# EAGLE design Schematic (EAGLE 8.4.0)
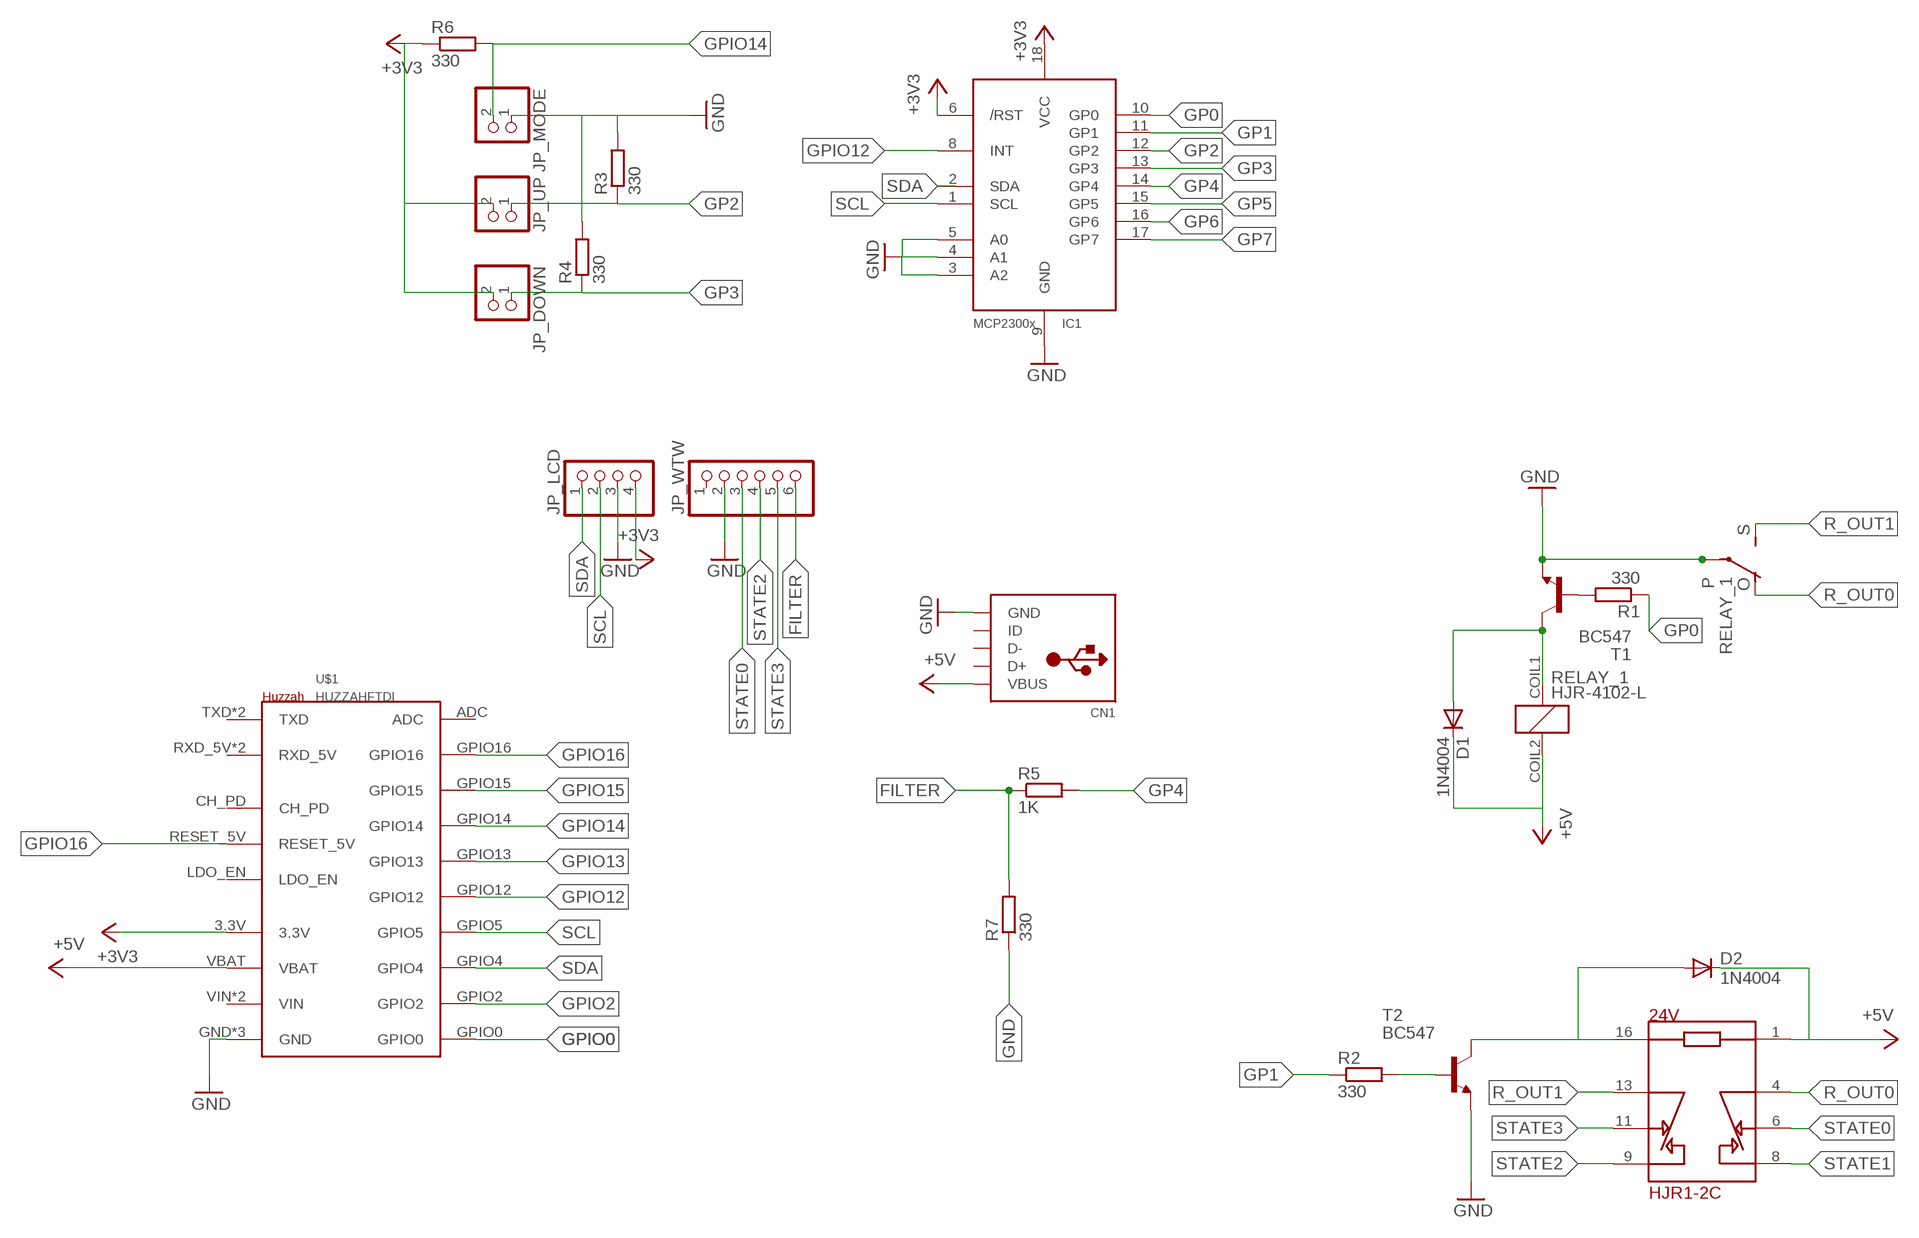
[diagram p0: schematic, sheet 1]

## Parts
CN1  USBTHM  [USB-MINIB-THM]
D1  1N4004  [DO41-10]
D2  1N4004  [DO41-10]
IC1  MCP23008/P  [DIL18]
JP_DOWN  PINHD-1X2  [1X02]
JP_LCD  PINHD-1X4  [1X04]
JP_MODE  PINHD-1X2  [1X02]
JP_UP  PINHD-1X2  [1X02]
JP_WTW  PINHD-1X6  [1X06]
R1  330  R-EU_0207/10  [0207/10]
R2  330  R-EU_0207/10  [0207/10]
R3  330  R-EU_0207/10  [0207/10]
R4  330  R-EU_0207/10  [0207/10]
R5  1K  R-EU_0207/10  [0207/10]
R6  330  R-EU_0207/10  [0207/10]
R7  330  R-EU_0207/10  [0207/10]
RELAY_1  HJR-4102-L  [HJR4102]
RELAY_2  HJR1-2C  [HJR1-2C]
T1  BC547  [TO92]
T2  BC547  [TO92]
U$1  HUZZAHFTDI  [HUZZAH-FULL]

## Nets
+3V3: IC1.6(/RST) IC1.18(VCC) JP_DOWN.2 JP_LCD.4 JP_UP.2 R6.1 U$1.3.3V
+5V: CN1.VBUS D1.C D2.C RELAY_1.COIL2 RELAY_2.1 U$1.VBAT
FILTER: JP_WTW.6 R5.1 R7.2
GND: CN1.GND IC1.3(A2) IC1.4(A1) IC1.5(A0) IC1.9(GND) JP_LCD.3 JP_MODE.1 JP_WTW.2 R3.2 R4.2 R7.1 RELAY_1.CENTER1(P) RELAY_1.CENTER2(P2) T1.1(E) T2.1(E) U$1.GND U$1.GND2(GND) U$1.GND3(GND)
GP0: IC1.10(GP0) R1.1
GP1: IC1.11(GP1) R2.1
GP2: IC1.12(GP2) JP_UP.1 R3.1
GP3: IC1.13(GP3) JP_DOWN.1 R4.1
GP4: IC1.14(GP4) R5.2
GP5: IC1.15(GP5)
GP6: IC1.16(GP6)
GP7: IC1.17(GP7)
GPIO0: U$1.GPIO0
GPIO2: U$1.GPIO2
GPIO12: IC1.8(INT) U$1.GPIO12
GPIO13: U$1.GPIO13
GPIO14: JP_MODE.2 R6.2 U$1.GPIO14
GPIO15: U$1.GPIO15
GPIO16: U$1.GPIO16 U$1.RESET_5V
N$1: R1.2 T1.2(B)
N$3: R2.2 T2.2(B)
R_OUT0: RELAY_1.CON2OPTION(O) RELAY_2.4
R_OUT1: RELAY_1.CON1DEFAULT(S) RELAY_2.13
SCL: IC1.1(SCL) JP_LCD.2 U$1.GPIO5
SDA: IC1.2(SDA) JP_LCD.1 U$1.GPIO4
STATE0: JP_WTW.3 RELAY_2.6
STATE1: RELAY_2.8
STATE2: JP_WTW.4 RELAY_2.9
STATE3: JP_WTW.5 RELAY_2.11
T1_RELAY1: D1.A RELAY_1.COIL1 T1.3(C)
T2_RELAY2: D2.A RELAY_2.16 T2.3(C)
Unconnected: CN1.D+ CN1.D- CN1.ID JP_WTW.1 U$1.ADC U$1.CH_PD U$1.LDO_EN U$1.RXD_5V U$1.RXD_5V-2(RXD_5V) U$1.TXD U$1.TXD2(TXD) U$1.VIN U$1.VIN2(VIN)

## Library data of the parts
CN1 = adafruit:USB: USB Connectors USBMINIB - Surface Mount Female Mini-B USB Connector 4UConnector: 06564 By microbuilder.eu Thru-hole RA Female Mini-B USB Connector 4UConnector: 18732 By ladyada.net
D1 D2 = diode:1N4004: DIODE general purpose rectifier, 1 A
IC1 = adafruit:MCP23008: MCP23008 Inexpensive i2c i/o expander - 8 general purpose i/o pins with optional pullups
JP_DOWN JP_MODE JP_UP = pinhead:PINHD-1X2: PIN HEADER
JP_LCD = pinhead:PINHD-1X4: PIN HEADER
JP_WTW = pinhead:PINHD-1X6: PIN HEADER
R1-R7 = resistor:R-EU_: RESISTOR, European symbol
RELAY_1 = relay:HJR-4102-L
RELAY_2 = hjr1-2c:HJR1-2C: TIANBO Relay 24VCD DPDT Configuration
T1 T2 = transistor:BC547: NPN TRANSISTOR
U$1 = tobias:HUZZAH: Adafruit Huzzah ESP8266 Footprint Fotprint to use the Huzzah. NOT TESTED Info: https://learn.adafruit.com/adafruit-huzzah-esp8266-breakout/overview Based on https://github.com/adafruit/Adafruit-Huzzah-ESP8266-Basic-Breakout-PCB

## Net classes
0 default: clearance 0.205 mm

## Board
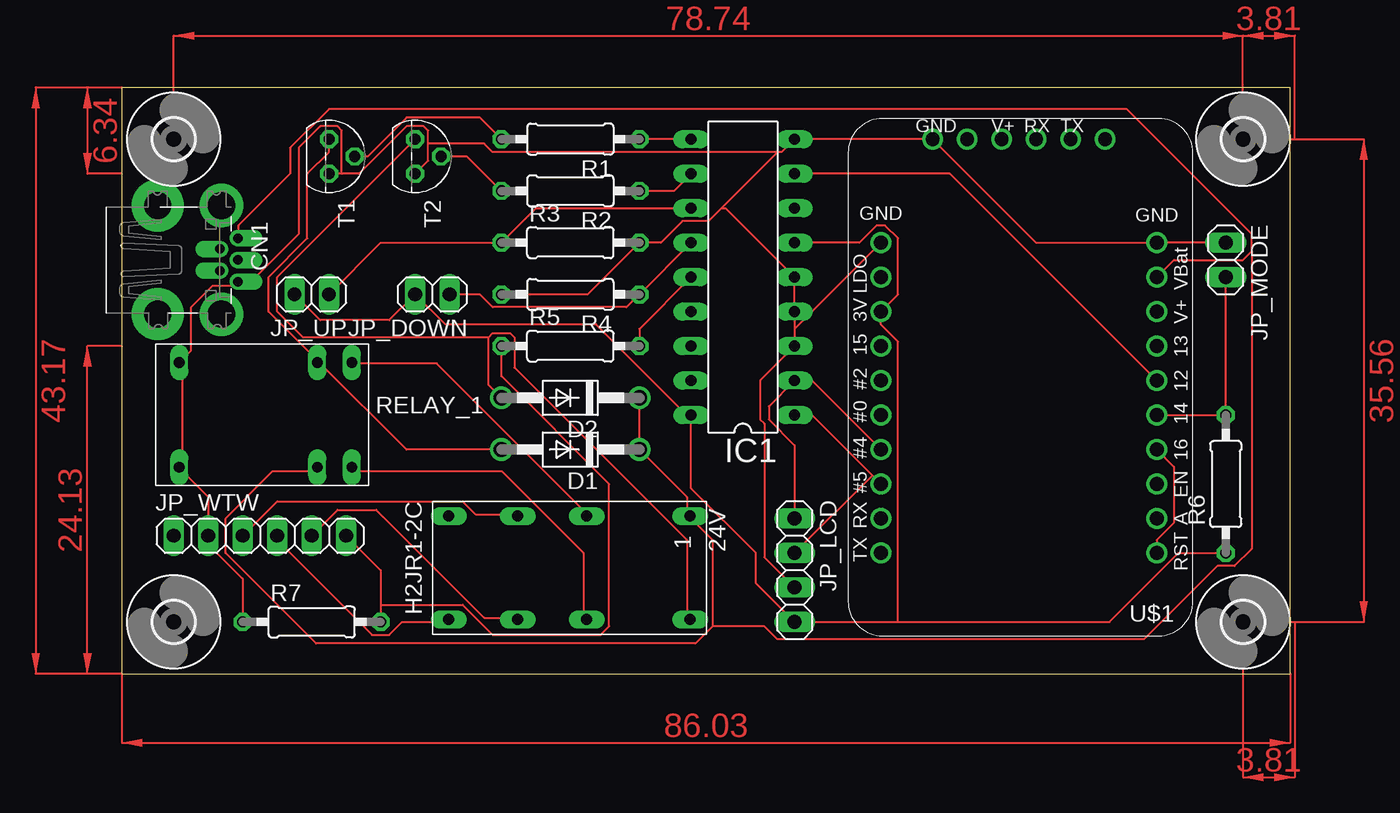
[diagram p1: board, top side]
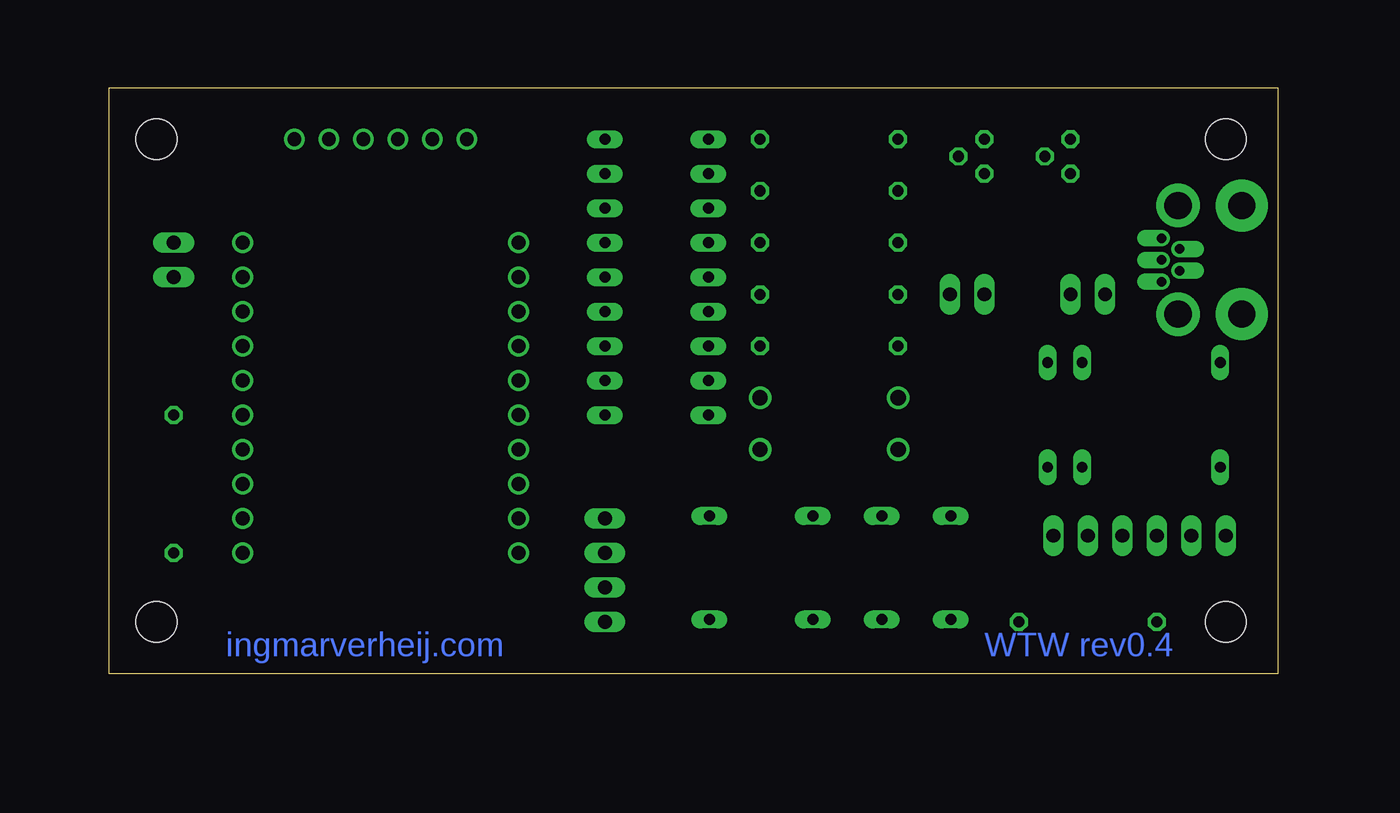
[diagram p2: board, bottom side, seen from below]

Size 86.03 x 43.17 mm. Coordinates in mm from the lower left corner, seen from the top.
Outline: 0,0 86.03,0 86.03,43.17 0,43.17 0,0
Copper layers (1*16): Top 0.035mm / dielectric 1.5mm / Bottom 0.035mm
Design rules "default": minimum track width 6mil, minimum drill 0.35mm, track to track 6mil, track to pad 6mil, pad to pad 6mil, via to via 6mil, smd to smd 6mil, copper to edge 40mil, drill to drill 6mil, minimum pad ring 10mil, minimum via ring 8mil, stop-mask expansion 4mil, vias tented up to drill 0mil, thermal gap 10mil

### Footprints (pad centres in the part's own frame; a part is rotated, then mirrored left to right if it is on the bottom)
USB-MINIB-THM = drill 0.7 offset: D+ 0,9.8; D- -0.8,8.5; GND 1.6,9.8; ID 0.8,8.5; VBUS -1.6,9.8 | drill 2 pad 3.81: GND1 -4,3.9; GND4 4,3.9 | drill 2 pad 3.2: GND2 -4,8.6; GND3 4,8.6
DO41-10 = drill 1.118: A 5.08,0; C -5.08,0
DIL18 = drill 0.813 long: 1 -10.16,-3.81; 2 -7.62,-3.81; 3 -5.08,-3.81; 4 -2.54,-3.81; 5 0,-3.81; 6 2.54,-3.81; 7 5.08,-3.81; 8 7.62,-3.81; 9 10.16,-3.81; 10 10.16,3.81; 11 7.62,3.81; 12 5.08,3.81; 13 2.54,3.81; 14 0,3.81; 15 -2.54,3.81; 16 -5.08,3.81; 17 -7.62,3.81; 18 -10.16,3.81
1X02 = drill 1.016 long: 1 -1.27,0; 2 1.27,0
1X04 = drill 1.016 long: 1 -3.81,0; 2 -1.27,0; 3 1.27,0; 4 3.81,0
1X06 = drill 1.016 long: 1 -6.35,0; 2 -3.81,0; 3 -1.27,0; 4 1.27,0; 5 3.81,0; 6 6.35,0
0207/10 = drill 0.813 octagon: 1 -5.08,0; 2 5.08,0
HJR4102 = drill 0.8 long: CENTER1 -5.933,3.877; CENTER2 -5.933,-3.839; COIL1 4.227,3.877; COIL2 4.227,-3.839; CON1DEFAULT 6.767,-3.839; CON2OPTION 6.767,3.877
HJR1-2C = drill 0.8 pad 1.016 long: 1 1.09,18.98; 4 1.09,11.36; 6 1.09,6.28; 8 1.09,1.2; 9 8.71,1.2; 11 8.71,6.28; 13 8.71,11.36; 16 8.71,18.98
TO92 = drill 0.813 octagon: 1 1.27,0; 2 0,1.905; 3 -1.27,0
HUZZAH-FULL = drill 1.016: 3.3V 22.86,13.97; ADC 2.54,29.21; CH_PD 2.54,26.67; GND 2.54,8.89; GND2 19.05,1.27; GND3 22.86,8.89; GPIO0 22.86,21.59; GPIO2 22.86,19.05; GPIO4 22.86,24.13; GPIO5 22.86,26.67; GPIO12 2.54,19.05; GPIO13 2.54,16.51; GPIO14 2.54,21.59; GPIO15 22.86,16.51; GPIO16 2.54,24.13; LDO_EN 22.86,11.43; P$22 16.51,1.27; P$26 6.35,1.27; RESET_5V 2.54,31.75; RXD_5V 11.43,1.27; RXD_5V-2 22.86,29.21; TXD 8.89,1.27; TXD2 22.86,31.75; VBAT 2.54,11.43; VIN 2.54,13.97; VIN2 13.97,1.27
3,0 = hole 3: 0,0

### Placement (x,y rotation side)
CN1  -1.27,30.48 270 top
D1  33.02,16.51 180 top
D2  33.02,20.32 180 top
IC1  45.72,29.21 90 top
JP_DOWN  22.86,27.94 180 top
JP_LCD  49.53,7.62 270 top
JP_MODE  81.28,30.48 270 top
JP_UP  13.97,27.94 180 top
JP_WTW  10.16,10.16 0 top
R1  33.02,39.37 180 top
R2  33.02,35.56 180 top
R3  33.02,31.75 0 top
R4  33.02,27.94 180 top
R5  33.02,24.13 0 top
R6  81.28,13.97 90 top
R7  13.97,3.81 0 top
RELAY_1  10.16,19.05 0 top
RELAY_2  22.86,12.7 270 top
T1  15.24,38.1 270 top
T2  21.59,38.1 270 top
U$1  78.74,40.64 180 top
U$2  [3,0]  3.81,3.81 0 top
U$3  [3,0]  82.55,3.81 0 top
U$4  [3,0]  3.81,39.37 0 top
U$5  [3,0]  82.55,39.37 0 top

### Tracks (layer width: path | path; a pad name or v marks a point on that pad's centre or on a via)
+3V3
  Top 0.152: IC1.6 54.29,31.75 55.56,33.02 56.2,33.02 57.15,32.07 57.15,27.94 U$1.3.3V 55.88,25.72 57.15,24.45 57.15,3.81 | JP_UP.2 14.61,26.03 19.69,26.03 JP_DOWN.2 23.81,25.72 34.93,25.72 41.91,18.73 | R6.1 77.79,8.89 72.71,3.81 57.15,3.81 | 57.15,3.81 JP_LCD.4 46.67,6.67 46.67,8.89 41.91,13.65 41.91,18.73 | 41.91,18.73 IC1.18
+5V
  Top 0.152: 43.5,3.49 42.23,2.22 14.29,2.22 7.62,8.89 7.62,11.43 11.11,14.92 14.29,14.92 RELAY_1.COIL2 | 43.5,3.49 43.5,9.84 41.91,11.43 RELAY_2.1 41.59,11.75 41.59,13.02 D1.C D2.C | 83.18,31.12 83.18,32.38 73.98,41.59 15.24,41.59 12.38,38.73 12.38,36.83 8.57,33.02 8.57,32.38 CN1.VBUS | 83.18,31.12 82.55,30.48 77.47,30.48 U$1.VBAT | 43.5,3.49 47.31,3.49 48.26,2.54 75.25,2.54 80.64,7.94 81.91,7.94 83.18,9.21 83.18,31.12
FILTER
  Top 0.152: 19.05,5.08 19.05,7.62 JP_WTW.6 | 19.05,5.08 R7.2 | R5.1 27.94,21.91 35.88,13.97 35.88,3.49 35.24,2.86 27.3,2.86 25.08,5.08 19.05,5.08
GND
  Top 0.152: 49.53,25.4 IC1.4 IC1.5 44.45,34.29 44.13,34.29 | 49.53,25.4 IC1.3 46.99,21.59 46.99,18.73 47.31,18.41 47.31,8.57 JP_LCD.3 | 49.53,25.4 U$1.GND3 | R7.1 8.89,6.98 6.35,9.52 JP_WTW.2 6.35,13.02 4.45,14.92 RELAY_1.CENTER2 4.45,15.24 4.45,22.86 RELAY_1.CENTER1 4.45,23.18 5.08,23.81 5.08,26.99 6.67,28.57 8.25,28.57 CN1.GND 8.57,28.89 9.52,28.89 13.02,32.38 13.02,38.73 14.61,40.32 15.88,40.32 16.19,40.01 16.19,36.83 | R4.2 34.29,27.94 R3.2 39.69,31.75 41.27,33.34 43.18,33.34 44.13,34.29 | 16.19,36.83 17.46,36.83 20.96,40.32 22.23,40.32 22.54,40.01 22.54,39.05 | 16.19,36.83 T1.1 | 22.54,39.05 22.54,37.78 T2.1 | JP_MODE.1 U$1.GND 67.31,31.75 U$1.GND2 IC1.9 48.58,38.42 48.26,38.42 | 22.54,39.05 26.67,39.05 27.3,38.42 48.26,38.42 | 48.26,38.42 44.13,34.29
GP0
  Top 0.152: IC1.10 R1.1
GP1
  Top 0.152: R2.1 40.64,35.56 IC1.11
GP2
  Top 0.152: JP_UP.1 19.05,31.75 R3.1 30.48,34.29 IC1.12
GP3
  Top 0.152: IC1.13 R4.1 37.15,26.99 27.3,26.99 26.35,27.94 JP_DOWN.1
GP4
  Top 0.152: R5.2 38.1,25.4 IC1.14
GPIO12
  Top 0.152: IC1.8 60.96,36.83 U$1.GPIO12
GPIO14
  Top 0.152: U$1.GPIO14 R6.2 JP_MODE.2
GPIO16
  Top 0.152: U$1.RESET_5V 76.2,9.84 77.47,11.11 77.47,15.24 U$1.GPIO16
N$1
  Top 0.152: T1.2 18.1,38.1 20.96,40.96 26.35,40.96 R1.2
N$3
  Top 0.152: T2.2 25.4,38.1 R2.2
R_OUT0
  Top 0.152: RELAY_1.CON2OPTION 17.14,22.86 23.18,22.86 34.29,11.75 RELAY_2.4
R_OUT1
  Top 0.152: RELAY_2.13 33.97,4.13 33.97,8.89 27.94,14.92 17.14,14.92 RELAY_1.CON1DEFAULT
SCL
  Top 0.152: IC1.1 50.8,19.05 55.24,14.6 | U$1.GPIO5 55.24,14.6 | 55.24,14.6 JP_LCD.2
SDA
  Top 0.152: U$1.GPIO4 50.8,21.59 IC1.2 47.62,19.68 47.62,18.73 49.53,16.83 JP_LCD.1
STATE0
  Top 0.152: JP_WTW.3 11.43,12.7 25.08,12.7 26.04,11.75 28.89,11.75 RELAY_2.6
STATE2
  Top 0.152: JP_WTW.4 11.43,9.84 18.41,2.86 19.69,2.86 20.64,3.81 23.81,3.81 RELAY_2.9
STATE3
  Top 0.152: JP_WTW.5 15.88,12.06 18.73,12.06 26.67,4.13 28.89,4.13 RELAY_2.11
T1_RELAY1
  Top 0.152: D1.A 20.96,16.51 14.61,22.86 RELAY_1.COIL1 14.29,23.18 10.8,26.67 10.8,29.21 13.65,32.07 13.65,36.83 15.24,38.42 T1.3
T2_RELAY2
  Top 0.152: 26.99,24.76 27.3,25.08 28.57,25.08 28.89,24.76 28.89,22.54 41.59,9.84 41.59,4.13 RELAY_2.16 | 26.99,24.76 26.99,21.27 D2.A | T2.3 11.43,29.21 11.43,26.67 13.34,24.76 26.99,24.76
(copper drawn outside any net)
  shapes: Top area x8

### Text on the board
Bottom: WTW rev0.4 | ingmarverheij.com